# EAGLE design front panel (EAGLE 9.6.2)
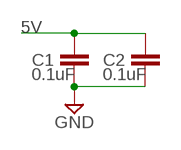
[diagram p0: schematic, sheet 1]

## Parts
C1  0.1uF  CAPACITOR_0805_N  [RESC0805_N]
C2  0.1uF  CAPACITOR_0805_N  [RESC0805_N]

## Nets
5V: C1.1 C2.1
GND: C1.2 C2.2

## Library data of the parts
C1 C2 = Nordic_nRF:CAPACITOR: Generic chip capacitor

## Net classes
0 default: width 0.305 mm
1 power: width 0.406 mm
2 gnd: width 0.305 mm

## Board
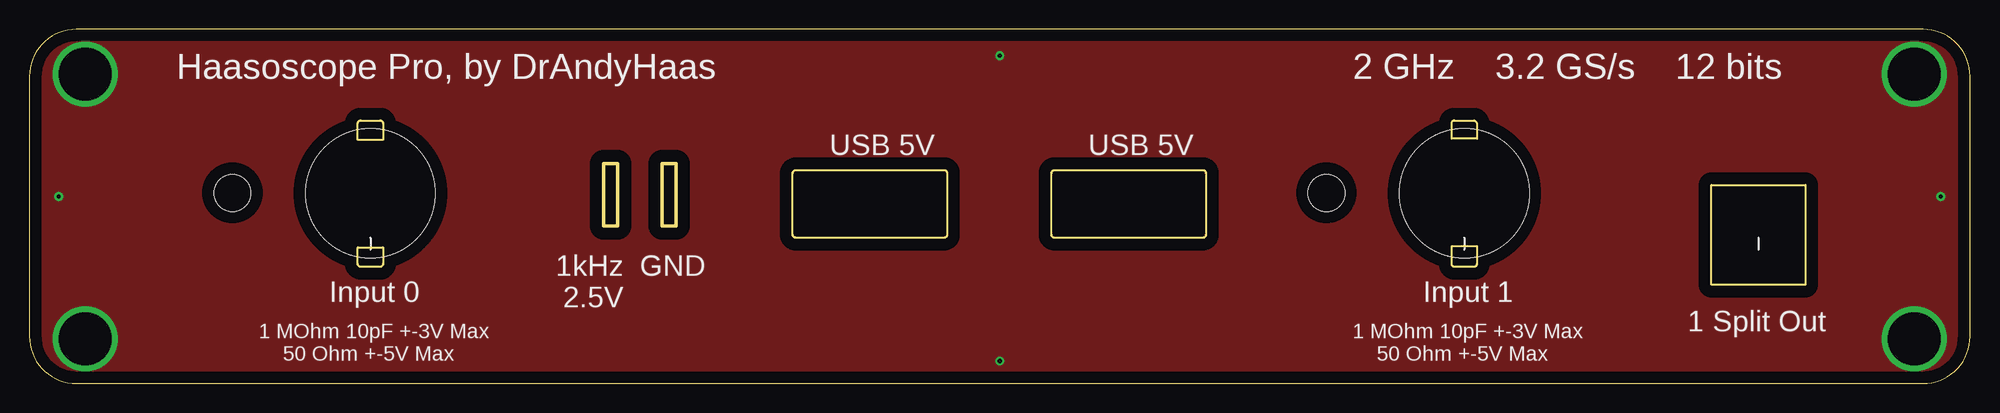
[diagram p1: board, top side]
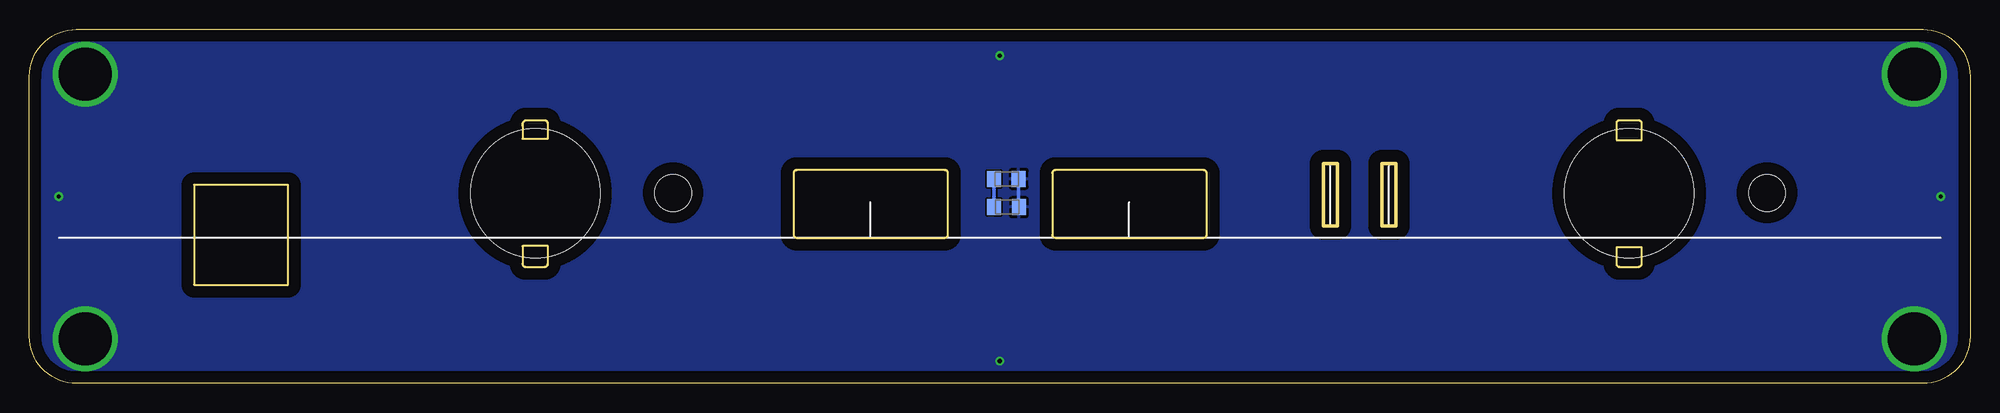
[diagram p2: board, bottom side, seen from below]

Size 165 x 30.13 mm. Coordinates in mm from the lower left corner, seen from the top.
Outline: 0,26.13 0,4 arc90 4,0 161,0 arc90 165,4 165,26.13 arc90 161,30.13 4,30.13 arc90 0,26.13
Outline: 86.9,12.65 86.9,17.9 arc-90 87.15,18.15 99.78,18.15 arc-90 100.03,17.9 100.03,12.65 arc-90 99.78,12.4 87.15,12.4 arc-90 86.9,12.65
Outline: 27.92,11.58 30.07,11.58 30.07,10.17 arc-90 29.82,9.92 28.17,9.92 arc-90 27.92,10.17 27.92,11.58
Outline: 27.92,20.72 27.92,22.13 arc-90 28.17,22.38 29.82,22.38 arc-90 30.07,22.13 30.07,20.72 27.92,20.72
Outline: 120.92,11.68 123.07,11.68 123.07,10.17 arc-90 122.82,9.92 121.17,9.92 arc-90 120.92,10.17 120.92,11.68
Outline: 120.92,20.82 120.92,22.13 arc-90 121.17,22.38 122.82,22.38 arc-90 123.07,21.93 123.07,20.82 120.92,20.82
Outline: 77.78,12.4 65.15,12.4 arc-90 64.9,12.65 64.9,17.9 arc-90 65.15,18.15 77.78,18.15 arc-90 78.03,17.9 78.03,12.65 arc-90 77.78,12.4
Outline: 151,8.4 143,8.4 143,16.9 151,16.9 151,8.4
Outline: 48.8,13.4 50,13.4 50,18.7 48.8,18.7 48.8,13.4
Outline: 53.8,13.4 55,13.4 55,18.7 53.8,18.7 53.8,13.4
Copper layers (1*16): Top 0.035mm / dielectric 1.5mm / Bottom 0.035mm
Design rules "default": minimum track width 6mil, minimum drill 0.35mm, track to track 6mil, track to pad 6mil, pad to pad 6mil, via to via 6mil, smd to smd 6mil, copper to edge 40mil, drill to drill 6mil, minimum pad ring 10mil, minimum via ring 8mil, stop-mask expansion 4mil, vias tented up to drill 0mil, thermal gap 10mil
Holes 11 mm at 29,16.17 122,16.17
Holes 3.1 mm at 17.27,16.21 110.27,16.21

### Footprints (pad centres in the part's own frame; a part is rotated, then mirrored left to right if it is on the bottom)
RESC0805_N = smd 1.2 x 1.35: 1 -1.1,0; 2 1,0

### Placement (x,y rotation side)
C1  81.88,15 0 bottom
C2  81.9,17.4 0 bottom

### Tracks (layer width: path | path; a pad name or v marks a point on that pad's centre or on a via)
5V
  Bottom 0.305: C2.1 83,15.02 C1.1
GND  (via drill 0.35, 4.5)
  Bottom 0.305: C2.2 80.9,15.02 C1.2
  other vias: 2.5,15.9 82.5,1.9 82.5,27.9 162.5,15.9 4.75,26.33 4.75,3.8 160.25,26.33 160.25,3.8
  pour Top: -0.3,30.5 165.1,30.5 165.6,30 165.6,-0.6 -0.5,-0.6 -0.9,-0.2 -0.9,30.1 -0.6,30.4 -0.5,30.5
  pour Bottom: -0.7,30.4 164.7,30.4 165.2,29.9 165.2,-0.7 -0.9,-0.7 -1.3,-0.3 -1.3,30 -1,30.3 -0.9,30.4

### Text on the board
tPlace: Haasoscope Pro, by DrAndyHaas | 2 GHz 3.2 GS/s 12 bits | USB 5V | USB 5V | 1kHz / 2.5V | GND | Input 0 | Input 1 | 1 Split Out | 1 MOhm 10pF +-3V Max / 50 Ohm +-5V Max | 1 MOhm 10pF +-3V Max / 50 Ohm +-5V Max